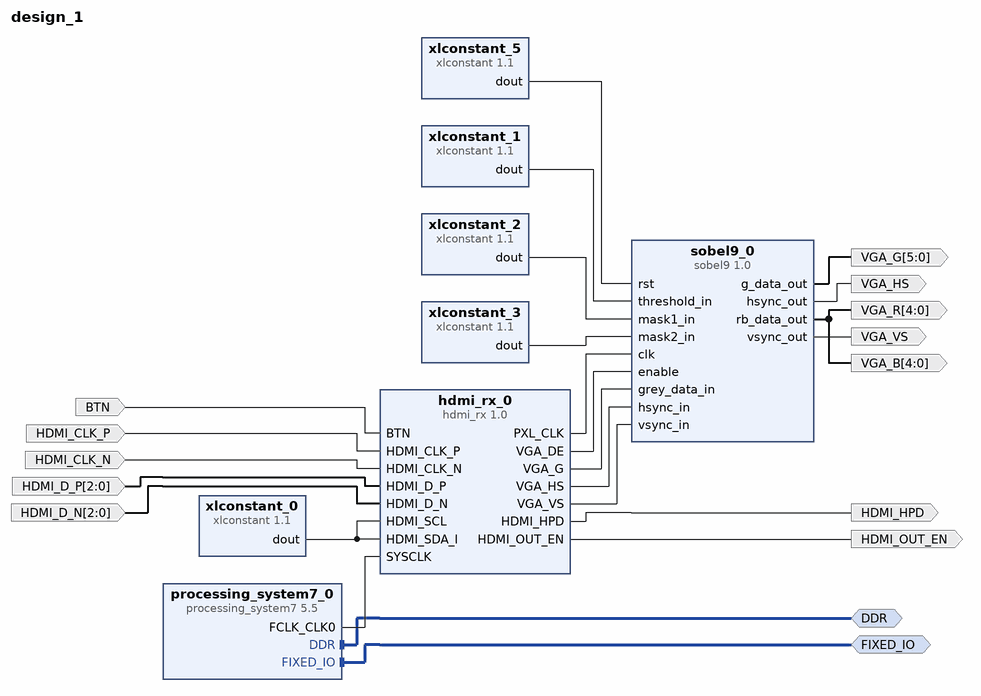
[diagram p0: block diagram of the top level]
# Vivado block design design_1, Vivado 2014.4
create_bd_design design_1

create_bd_intf_port -mode Master -vlnv xilinx.com:interface:ddrx_rtl:1.0 DDR
create_bd_intf_port -mode Master -vlnv xilinx.com:display_processing_system7:fixedio_rtl:1.0 FIXED_IO
create_bd_port -dir I BTN
create_bd_port -dir I HDMI_CLK_P
create_bd_port -dir I HDMI_CLK_N
create_bd_port -dir I -from 2 -to 0 HDMI_D_P
create_bd_port -dir I -from 2 -to 0 HDMI_D_N
create_bd_port -dir O HDMI_OUT_EN
create_bd_port -dir O HDMI_HPD
create_bd_port -dir O -from 4 -to 0 VGA_B
create_bd_port -dir O -from 4 -to 0 VGA_R
create_bd_port -dir O VGA_HS
create_bd_port -dir O VGA_VS
create_bd_port -dir O -from 5 -to 0 VGA_G

create_bd_cell -type ip -vlnv xilinx.com:ip:processing_system7:5.5 processing_system7_0
set_property -dict [list \
  CONFIG.PCW_UIPARAM_DDR_FREQ_MHZ 525 \
  CONFIG.PCW_CRYSTAL_PERIPHERAL_FREQMHZ 50.000000 \
  CONFIG.PCW_APU_PERIPHERAL_FREQMHZ 650 \
  CONFIG.PCW_SDIO_PERIPHERAL_FREQMHZ 50 \
  CONFIG.PCW_FPGA0_PERIPHERAL_FREQMHZ 100 \
  CONFIG.PCW_USE_M_AXI_GP0 0 \
  CONFIG.PCW_PRESET_BANK1_VOLTAGE {LVCMOS 1.8V} \
  CONFIG.PCW_UIPARAM_DDR_PARTNO {MT41K128M16 JT-125} \
  CONFIG.PCW_QSPI_PERIPHERAL_ENABLE 1 \
  CONFIG.PCW_QSPI_GRP_SINGLE_SS_ENABLE 1 \
  CONFIG.PCW_QSPI_GRP_FBCLK_ENABLE 1 \
  CONFIG.PCW_ENET0_PERIPHERAL_ENABLE 1 \
  CONFIG.PCW_ENET0_ENET0_IO {MIO 16 .. 27} \
  CONFIG.PCW_ENET0_GRP_MDIO_ENABLE 1 \
  CONFIG.PCW_ENET0_RESET_ENABLE 0 \
  CONFIG.PCW_SD0_PERIPHERAL_ENABLE 1 \
  CONFIG.PCW_SD0_GRP_CD_ENABLE 1 \
  CONFIG.PCW_SD0_GRP_CD_IO {MIO 47} \
  CONFIG.PCW_SD0_GRP_WP_ENABLE 1 \
  CONFIG.PCW_UART1_PERIPHERAL_ENABLE 1 \
  CONFIG.PCW_TTC0_PERIPHERAL_ENABLE 1 \
  CONFIG.PCW_USB0_PERIPHERAL_ENABLE 1 \
  CONFIG.PCW_USB0_RESET_ENABLE 1 \
  CONFIG.PCW_USB0_RESET_IO {MIO 46} \
  CONFIG.PCW_GPIO_MIO_GPIO_ENABLE 1 \
  CONFIG.preset {Default*} \
] [get_bd_cells processing_system7_0]
# 105 more settings of processing_system7_0 are not shown: defaults, MIO pin electricals, DDR timing, and values the tool derives
create_bd_cell -type ip -vlnv user.org:user:hdmi_rx:1.0 hdmi_rx_0
create_bd_cell -type ip -vlnv xilinx.com:ip:xlconstant:1.1 xlconstant_0
set_property -dict {CONFIG.CONST_VAL 0} [get_bd_cells xlconstant_0]
create_bd_cell -type ip -vlnv xilinx.com:ip:xlconstant:1.1 xlconstant_1
set_property -dict {CONFIG.CONST_WIDTH 10 CONFIG.CONST_VAL 50} [get_bd_cells xlconstant_1]
create_bd_cell -type ip -vlnv xilinx.com:ip:xlconstant:1.1 xlconstant_2
set_property -dict {CONFIG.CONST_WIDTH 27 CONFIG.CONST_VAL 117900737} [get_bd_cells xlconstant_2]
create_bd_cell -type ip -vlnv xilinx.com:ip:xlconstant:1.1 xlconstant_3
set_property -dict {CONFIG.CONST_WIDTH 27 CONFIG.CONST_VAL 117900737} [get_bd_cells xlconstant_3]
create_bd_cell -type ip -vlnv xilinx.com:ip:xlconstant:1.1 xlconstant_5
set_property -dict {CONFIG.CONST_VAL 0} [get_bd_cells xlconstant_5]
create_bd_cell -type ip -vlnv user.org:user:sobel9:1.0 sobel9_0

# ---- connections ----

connect_bd_intf_net [get_bd_intf_ports DDR] [get_bd_intf_pins processing_system7_0/DDR]
connect_bd_intf_net [get_bd_intf_ports FIXED_IO] [get_bd_intf_pins processing_system7_0/FIXED_IO]
connect_bd_net [get_bd_pins processing_system7_0/FCLK_CLK0] [get_bd_pins hdmi_rx_0/SYSCLK]
connect_bd_net [get_bd_ports BTN] [get_bd_pins hdmi_rx_0/BTN]
connect_bd_net [get_bd_ports HDMI_CLK_P] [get_bd_pins hdmi_rx_0/HDMI_CLK_P]
connect_bd_net [get_bd_ports HDMI_CLK_N] [get_bd_pins hdmi_rx_0/HDMI_CLK_N]
connect_bd_net [get_bd_ports HDMI_D_P] [get_bd_pins hdmi_rx_0/HDMI_D_P]
connect_bd_net [get_bd_ports HDMI_D_N] [get_bd_pins hdmi_rx_0/HDMI_D_N]
connect_bd_net [get_bd_pins hdmi_rx_0/HDMI_OUT_EN] [get_bd_ports HDMI_OUT_EN]
connect_bd_net [get_bd_pins hdmi_rx_0/HDMI_HPD] [get_bd_ports HDMI_HPD]
connect_bd_net [get_bd_pins xlconstant_0/dout] [get_bd_pins hdmi_rx_0/HDMI_SCL] [get_bd_pins hdmi_rx_0/HDMI_SDA_I]
connect_bd_net -net sobel4_0_rb_data_out [get_bd_pins sobel9_0/rb_data_out] [get_bd_ports VGA_R] [get_bd_ports VGA_B]
connect_bd_net [get_bd_pins xlconstant_5/dout] [get_bd_pins sobel9_0/rst]
connect_bd_net [get_bd_pins xlconstant_1/dout] [get_bd_pins sobel9_0/threshold_in]
connect_bd_net [get_bd_pins xlconstant_2/dout] [get_bd_pins sobel9_0/mask1_in]
connect_bd_net [get_bd_pins xlconstant_3/dout] [get_bd_pins sobel9_0/mask2_in]
connect_bd_net [get_bd_pins hdmi_rx_0/PXL_CLK] [get_bd_pins sobel9_0/clk]
connect_bd_net [get_bd_pins hdmi_rx_0/VGA_DE] [get_bd_pins sobel9_0/enable]
connect_bd_net [get_bd_pins hdmi_rx_0/VGA_G] [get_bd_pins sobel9_0/grey_data_in]
connect_bd_net [get_bd_pins sobel9_0/g_data_out] [get_bd_ports VGA_G]
connect_bd_net [get_bd_pins hdmi_rx_0/VGA_HS] [get_bd_pins sobel9_0/hsync_in]
connect_bd_net [get_bd_pins hdmi_rx_0/VGA_VS] [get_bd_pins sobel9_0/vsync_in]
connect_bd_net [get_bd_pins sobel9_0/hsync_out] [get_bd_ports VGA_HS]
connect_bd_net [get_bd_pins sobel9_0/vsync_out] [get_bd_ports VGA_VS]

validate_bd_design
save_bd_design
